# Altium schematic sheet LamplightController.SchDoc: Контроллер
size 420 x 297 mm; Author: Беляев Д.В.; Address1: Address1; Address2: Address2; Address3: Address3; Address4: Address4; DocumentNumber: АБВГ.123456.001 Э3; SheetNumber: 1; SheetTotal: 1; Scale: 1:1; Title2str: освещения; Letter1Column: -; DocumentType: Схема электрическая принципиальная; FirstReferrence: АБВГ.123456.001; PageSetup: Record=PageOptions|CenterHorizontal=True|CenterVertical=True|PrintScale=0.67|XCorrection=1.00|YCorrection=1.00|PrintKind=1|BorderSize=5000000|LeftOffset=0|BottomOffset=0|Orientation=2|PaperLength=1000|PaperWidth=1000|Scale=100|PaperSource=7|PrintQuality=1200|MediaType=1|DitherType=10|PaperKind=A4|PrintScaleMode=1
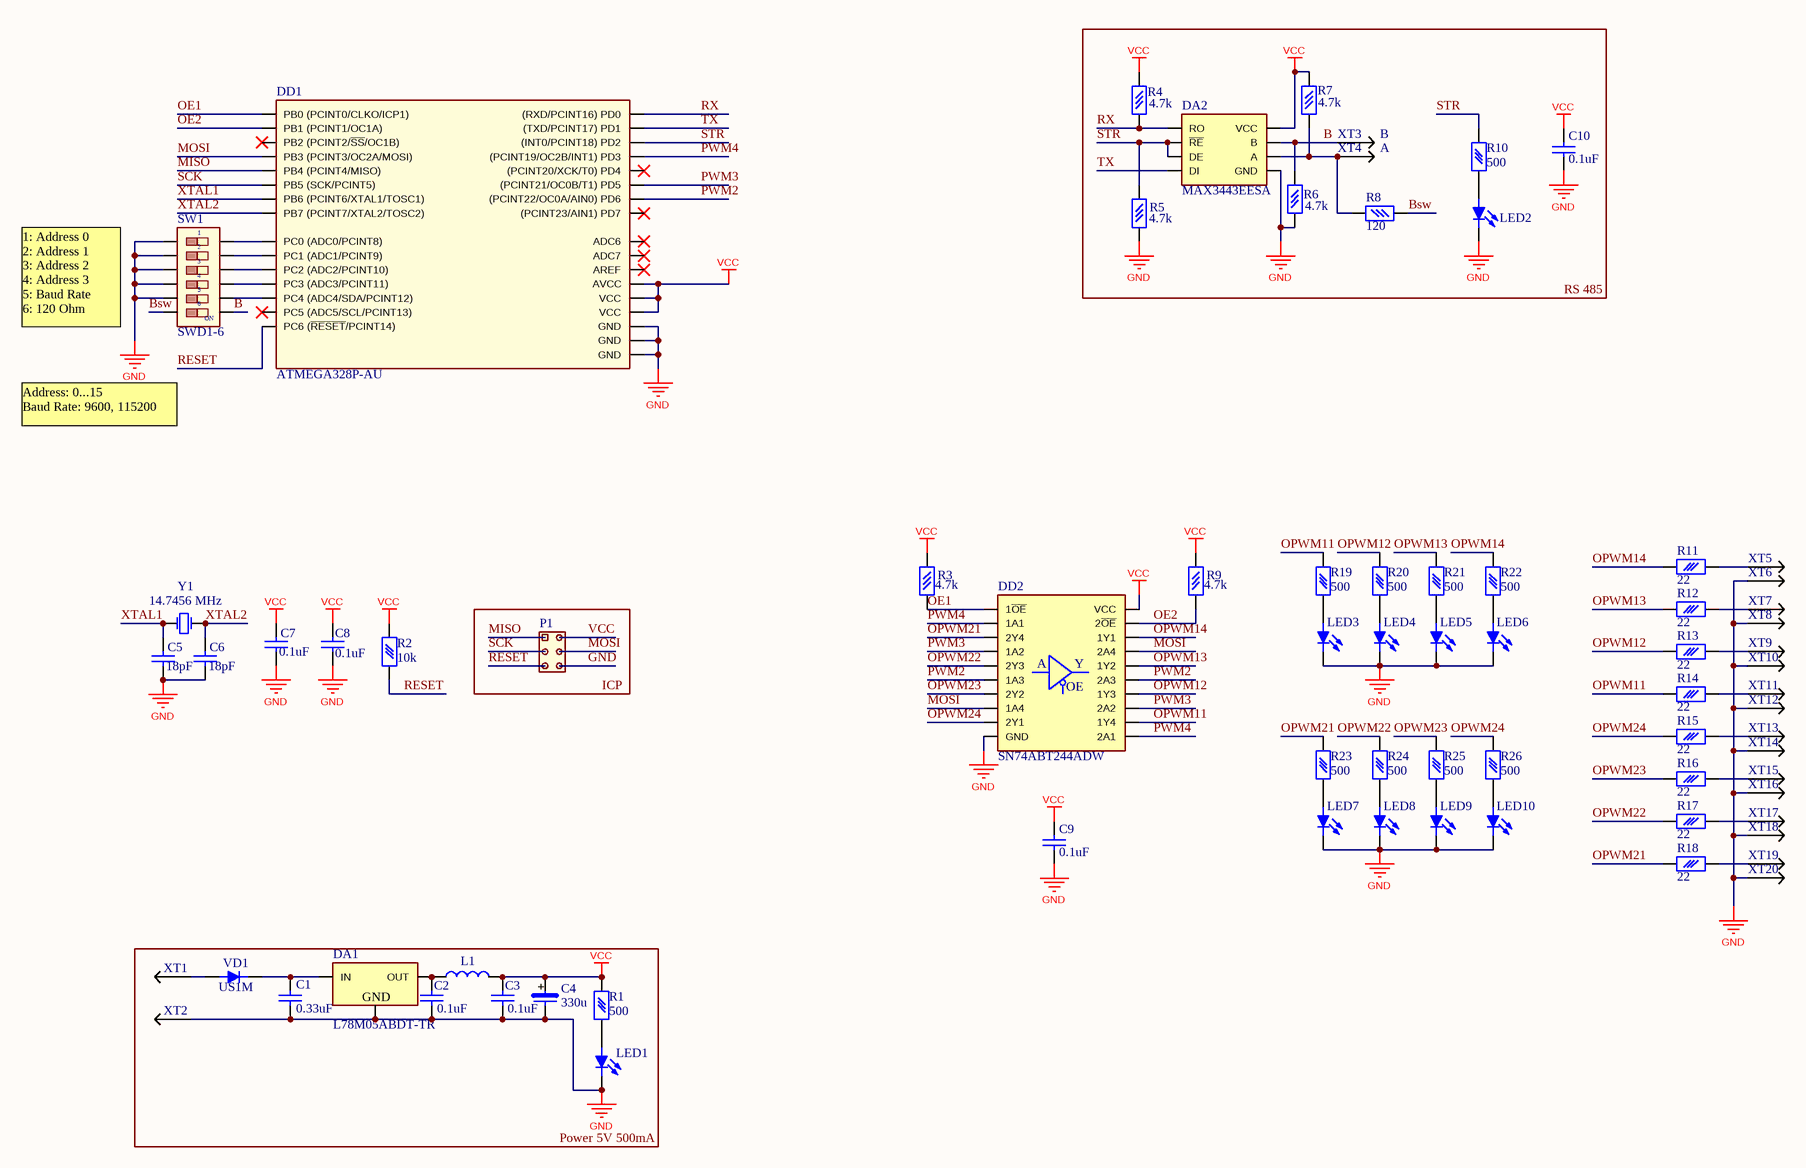
[diagram p0: LamplightController.SchDoc]

## Parts
C1  value 0.33uF  [1206_CAP]  (hidden comment: C_1206)
C2  value 0.1uF  [0603_CAP]  (hidden comment: C_0603)
C3  value 0.1uF  [0603_CAP]  (hidden comment: C_0603)
C4  value 330u  [case D]  (hidden comment: C_caseD)
C5  value 18pF  [0603_CAP]  (hidden comment: C_0603)
C6  value 18pF  [0603_CAP]  (hidden comment: C_0603)
C7  value 0.1uF  [0603_CAP]  (hidden comment: C_0603)
C8  value 0.1uF  [0603_CAP]  (hidden comment: C_0603)
C9  value 0.1uF  [0603_CAP]  (hidden comment: C_0603)
C10  value 0.1uF  [0603_CAP]  (hidden comment: C_0603)
DA1  L78M05ABDT-TR  [DPACK]
DA2  MAX3443EESA  [SOIC8]
DD1  ATMEGA328P-AU  [TQFP32]
DD2  SN74ABT244ADW  [SOIC20]
L1  BLM21  [0805_IND]  (value not drawn)
LED1  LED_0603  [0603_LED]  (value not drawn)
LED2  LED_0603  [0603_LED]  (value not drawn)
LED3  LED_0603  [0603_LED]  (value not drawn)
LED4  LED_0603  [0603_LED]  (value not drawn)
LED5  LED_0603  [0603_LED]  (value not drawn)
LED6  LED_0603  [0603_LED]  (value not drawn)
LED7  LED_0603  [0603_LED]  (value not drawn)
LED8  LED_0603  [0603_LED]  (value not drawn)
LED9  LED_0603  [0603_LED]  (value not drawn)
LED10  LED_0603  [0603_LED]  (value not drawn)
P1  BH-06M  [BH-06M]  (value not drawn)
R1  value 500  [0603_RES]  (hidden comment: R_0603)
R2  value 10k  [0603_RES]  (hidden comment: R_0603)
R3  value 4.7k  [0603_RES]  (hidden comment: R_0603)
R4  value 4.7k  [0603_RES]  (hidden comment: R_0603)
R5  value 4.7k  [0603_RES]  (hidden comment: R_0603)
R6  value 4.7k  [0603_RES]  (hidden comment: R_0603)
R7  value 4.7k  [0603_RES]  (hidden comment: R_0603)
R8  value 120  [0603_RES]  (hidden comment: R_0603)
R9  value 4.7k  [0603_RES]  (hidden comment: R_0603)
R10  value 500  [0603_RES]  (hidden comment: R_0603)
R11  value 22  [0603_RES]  (hidden comment: R_0603)
R12  value 22  [0603_RES]  (hidden comment: R_0603)
R13  value 22  [0603_RES]  (hidden comment: R_0603)
R14  value 22  [0603_RES]  (hidden comment: R_0603)
R15  value 22  [0603_RES]  (hidden comment: R_0603)
R16  value 22  [0603_RES]  (hidden comment: R_0603)
R17  value 22  [0603_RES]  (hidden comment: R_0603)
R18  value 22  [0603_RES]  (hidden comment: R_0603)
R19  value 500  [0603_RES]  (hidden comment: R_0603)
R20  value 500  [0603_RES]  (hidden comment: R_0603)
R21  value 500  [0603_RES]  (hidden comment: R_0603)
R22  value 500  [0603_RES]  (hidden comment: R_0603)
R23  value 500  [0603_RES]  (hidden comment: R_0603)
R24  value 500  [0603_RES]  (hidden comment: R_0603)
R25  value 500  [0603_RES]  (hidden comment: R_0603)
R26  value 500  [0603_RES]  (hidden comment: R_0603)
SW1  SWD1-6  [DIP_SW 12]
VD1  US1M  [SMA]
XT1  235-101  [wago235-101]  (value not drawn)
XT2  235-101  [wago235-101]  (value not drawn)
XT3  235-101  [wago235-101]  (value not drawn)
XT4  235-101  [wago235-101]  (value not drawn)
XT5  235-101  [wago235-101]  (value not drawn)
XT6  235-101  [wago235-101]  (value not drawn)
XT7  235-101  [wago235-101]  (value not drawn)
XT8  235-101  [wago235-101]  (value not drawn)
XT9  235-101  [wago235-101]  (value not drawn)
XT10  235-101  [wago235-101]  (value not drawn)
XT11  235-101  [wago235-101]  (value not drawn)
XT12  235-101  [wago235-101]  (value not drawn)
XT13  235-101  [wago235-101]  (value not drawn)
XT14  235-101  [wago235-101]  (value not drawn)
XT15  235-101  [wago235-101]  (value not drawn)
XT16  235-101  [wago235-101]  (value not drawn)
XT17  235-101  [wago235-101]  (value not drawn)
XT18  235-101  [wago235-101]  (value not drawn)
XT19  235-101  [wago235-101]  (value not drawn)
XT20  235-101  [wago235-101]  (value not drawn)
Y1  value 14.7456 MHz  [HC49S]  (hidden comment: HC49S)

## Blocks framed on the sheet
ICP: P1
Power 5V 500mA: C1-C4 DA1 L1 LED1 R1 VD1 XT1 XT2

## Nets
GND: C1.1 C2.1 C3.1 C4.2(-) C5.1 C6.1 C7.1 C8.1 C9.2 C10.2 DA1.3(GND) DA2.5(GND) DD1.3(GND) DD1.5(GND) DD1.21(GND) DD2.10(GND) LED1.2(C) LED2.2(C) LED3.2(C) LED4.2(C) LED5.2(C) LED6.2(C) LED7.2(C) LED8.2(C) LED9.2(C) LED10.2(C) P1.6 R5.1 R6.1 SW1.1 SW1.2 SW1.3 SW1.4 SW1.5 XT2.1 XT6.1 XT8.1 XT10.1 XT12.1 XT14.1 XT16.1 XT18.1 XT20.1
VCC: C3.2 C4.1(+) C7.2 C8.2 C9.1 C10.1 DA2.8(VCC) DD1.4(VCC) DD1.6(VCC) DD1.18(AVCC) DD2.20(VCC) L1.2 P1.2 R1.2 R2.2 R3.2 R4.2 R7.2 R9.2
B: DA2.7(B) R6.2 SW1.7 XT3.1
Bsw: R8.2 SW1.6
MISO: DD1.16(PB4_(PCINT4/MISO)) P1.1
MOSI: DD1.15(PB3_(PCINT3/OC2A/MOSI)) DD2.8(1A4) DD2.17(2A4) P1.4
OE1: DD1.12(PB0_(PCINT0/CLKO/ICP1)) DD2.1(1~{OE}) R3.1
OE2: DD1.13(PB1_(PCINT1/OC1A)) DD2.19(2~{OE}) R9.1
OPWM11: DD2.12(1Y4) R14.2 R19.1
OPWM12: DD2.14(1Y3) R13.2 R20.1
OPWM13: DD2.16(1Y2) R12.2 R21.1
OPWM14: DD2.18(1Y1) R11.2 R22.1
OPWM21: DD2.3(2Y4) R18.2 R23.1
OPWM22: DD2.5(2Y3) R17.2 R24.1
OPWM23: DD2.7(2Y2) R16.2 R25.1
OPWM24: DD2.9(2Y1) R15.2 R26.1
PWM2: DD1.10((PCINT22/OC0A/AIN0)_PD6) DD2.6(1A3) DD2.15(2A3)
PWM3: DD1.9((PCINT21/OC0B/T1)_PD5) DD2.4(1A2) DD2.13(2A2)
PWM4: DD1.1((PCINT19/OC2B/INT1)_PD3) DD2.2(1A1) DD2.11(2A1)
RESET: DD1.29(PC6_(~{RESET}/PCINT14)) P1.5 R2.1
RX: DA2.1(RO) DD1.30((RXD/PCINT16)_PD0) R4.1
SCK: DD1.17(PB5_(SCK/PCINT5)) P1.3
STR: DA2.2(~{RE}) DA2.3(DE) DD1.32((INT0/PCINT18)_PD2) R5.2 R10.2
TX: DA2.4(DI) DD1.31((TXD/PCINT17)_PD1)
XTAL1: C5.2 DD1.7(PB6_(PCINT6/XTAL1/TOSC1)) Y1.2(OSC2)
XTAL2: C6.2 DD1.8(PB7_(PCINT7/XTAL2/TOSC2)) Y1.1(OSC1)
NetC1_2: C1.2 DA1.1(IN) VD1.2(C)
NetC2_2: C2.2 DA1.2(OUT) L1.1
NetDA2_6: DA2.6(A) R7.1 R8.1 XT4.1
NetDD1_23: DD1.23(PC0_(ADC0/PCINT8)) SW1.12
NetDD1_24: DD1.24(PC1_(ADC1/PCINT9)) SW1.11
NetDD1_25: DD1.25(PC2_(ADC2/PCINT10)) SW1.10
NetDD1_26: DD1.26(PC3_(ADC3/PCINT11)) SW1.9
NetDD1_27: DD1.27(PC4_(ADC4/SDA/PCINT12)) SW1.8
NetLED1_1: LED1.1(A) R1.1
NetLED2_1: LED2.1(A) R10.1
NetLED3_1: LED3.1(A) R19.2
NetLED4_1: LED4.1(A) R20.2
NetLED5_1: LED5.1(A) R21.2
NetLED6_1: LED6.1(A) R22.2
NetLED7_1: LED7.1(A) R23.2
NetLED8_1: LED8.1(A) R24.2
NetLED9_1: LED9.1(A) R25.2
NetLED10_1: LED10.1(A) R26.2
NetR11_1: R11.1 XT5.1
NetR12_1: R12.1 XT7.1
NetR13_1: R13.1 XT9.1
NetR14_1: R14.1 XT11.1
NetR15_1: R15.1 XT13.1
NetR16_1: R16.1 XT15.1
NetR17_1: R17.1 XT17.1
NetR18_1: R18.1 XT19.1
NetVD1_1: VD1.1(A) XT1.1

Not connected (* = marked no-connect by the designer): DD1 2((PCINT20/XCK/T0)_PD4)* 11((PCINT23/AIN1)_PD7)* 14(PB2_(PCINT2/~{SS}/OC1B))* 19(ADC6)* 20(AREF)* 22(ADC7)* 28(PC5_(ADC5/SCL/PCINT13))*

## Notes on the sheet
- B
- A
- RS 485
- (near SW1) 1: Address 0
  2: Address 1
  3: Address 2
  4: Address 3
  5: Baud Rate
  6: 120 Ohm
- Address: 0...15
  Baud Rate: 9600, 115200
- Перв. примен.
- Справ. №
- Подп. и дата
- Инв. № дубл.
- Взам. инв. №
- Разраб.
- Изм.
- Лист
- № докум.
- Подп.
- Дата
- Лит.
- Масса
- Масштаб
- Пров.
- Т.контр.
- Листов
- Инв. № подл.
- Утв.
- Н.контр.
- 2.106-A3
- Копировал
- Формат А3
- (in symbol SN74ABT244ADW) A; Y; OE
- (in symbol SWD1-6) ON

## Library data of the parts
C1 = C_1206: Конденсатор (1206)
C2 C3 C5-C10 = C_0603: Конденсатор (0603)
C4 = C_caseD: Танаталовый чип конденсатор (Case D)
DA1 = L78M05ABDT-TR: Precision 500 mA regulator 5V; Supplier 1: Farnell; Supplier Part Number 1: 1366575
DA2 = MAX3443EESA: 5 V RS-485 Transceiver; Manufacturer: Maxim Integrated Products; Manufacturer Part Number: MAX3443EESA+; Voltage - Supply: 4.75 V ~ 5.25 V; Package / Case: 8-SOIC (0.154", 3.90mm Width); Supplier Device Package: 8-SOIC; Supplier 1: Farnell; Supplier Part Number 1: 1593360
DD1 = ATMEGA328P-AU: ATMEL 8-BIT MICROCONTROLLER WITH 32KBYTES  IN-SYSTEM PROGRAMMABLE FLASH 2K RAM 20MHz; Supplier 1: Mouser; Supplier Part Number 1: 556-ATMEGA328P-AU
DD2 = SN74ABT244ADW: Octal Buffers/Drivers with 3-state outputs; Supplier 1: Farnell; Supplier Part Number 1: 2436758
L1 = BLM21: Chip Ferrite Bead (0805 Size) BLM21PG221SH1; VALUE: *; Supplier 1: Digi-Key; Supplier Part Number 1: 490-1052-6-ND
LED1-LED10 = LED_0603: Светодиод 0603
R1 R2 R10-R26 = R_0603: Резистор 0.1 Вт (0603)
R3-R9 = R_0603: Резистор 0.063 Вт (0603)
SW1 = SWD1-6: DIP-переключатель 2-х полож. 6 кн. 2.54mm
VD1 = US1M: Диод 1А до 1000V; Manufacturer: Diodes Inc; Manufacturer Part Number: US1J-13-F; Current - Average Rectified (Io): 1A; Current - Reverse Leakage @ Vr: 5µA @ 600V; Speed: Fast Recovery =< 500ns, > 200mA (Io); Voltage - DC Reverse (Vr) (Max): 600V; Voltage - Forward (Vf) (Max) @ If: 1.7V @ 1A; Package / Case: DO-214AC, SMA; ComponentLink1URL: http://www.diodes.com/datasheets/ds16008.pdf; ComponentLink1Description: http://www.diodes.com/datasheets/ds16008.pdf; Supplier 1: Newark; Supplier Part Number 1: 03P9946
XT1-XT20 = wago235-101: 235-101 - 1-CONDUCTOR PCB TERMINAL BLOCK 2 SOLDER PINS / POLE 1 POLE PIN SPACING 3.81 MM / 0.15 IN WITH PUSH BOTTONS; Supplier 1: Newark; Supplier Part Number 1: 28K9170
Y1 = Quartz_HC49S: Кварцевый резонатор (HC49S); Supplier 1: Newark; Supplier Part Number 1: 33P6957